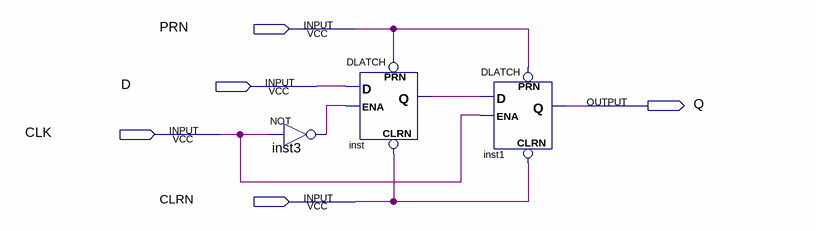
[diagram p0: schematic sheet]
// Quartus schematic Emdad_03_14_2022_d_latch_master_slave.bdf as structural Verilog: 3 symbols, 5 pins
module Emdad_03_14_2022_d_latch_master_slave (
  input  PRN,
  input  D,
  input  CLK,
  input  CLRN,
  output Q
);

  wire inst3_out, inst_q;

  not inst3 (inst3_out, CLK);
  DLATCH inst (.CLRN(CLRN), .D(D), .ENA(inst3_out), .PRN(PRN), .Q(inst_q));
  DLATCH inst1 (.CLRN(CLRN), .D(inst_q), .ENA(CLK), .PRN(PRN), .Q(Q));
endmodule
